# Altium schematic sheet Sheet1.SchDoc
size A; SheetNumber: 1; SheetTotal: 1
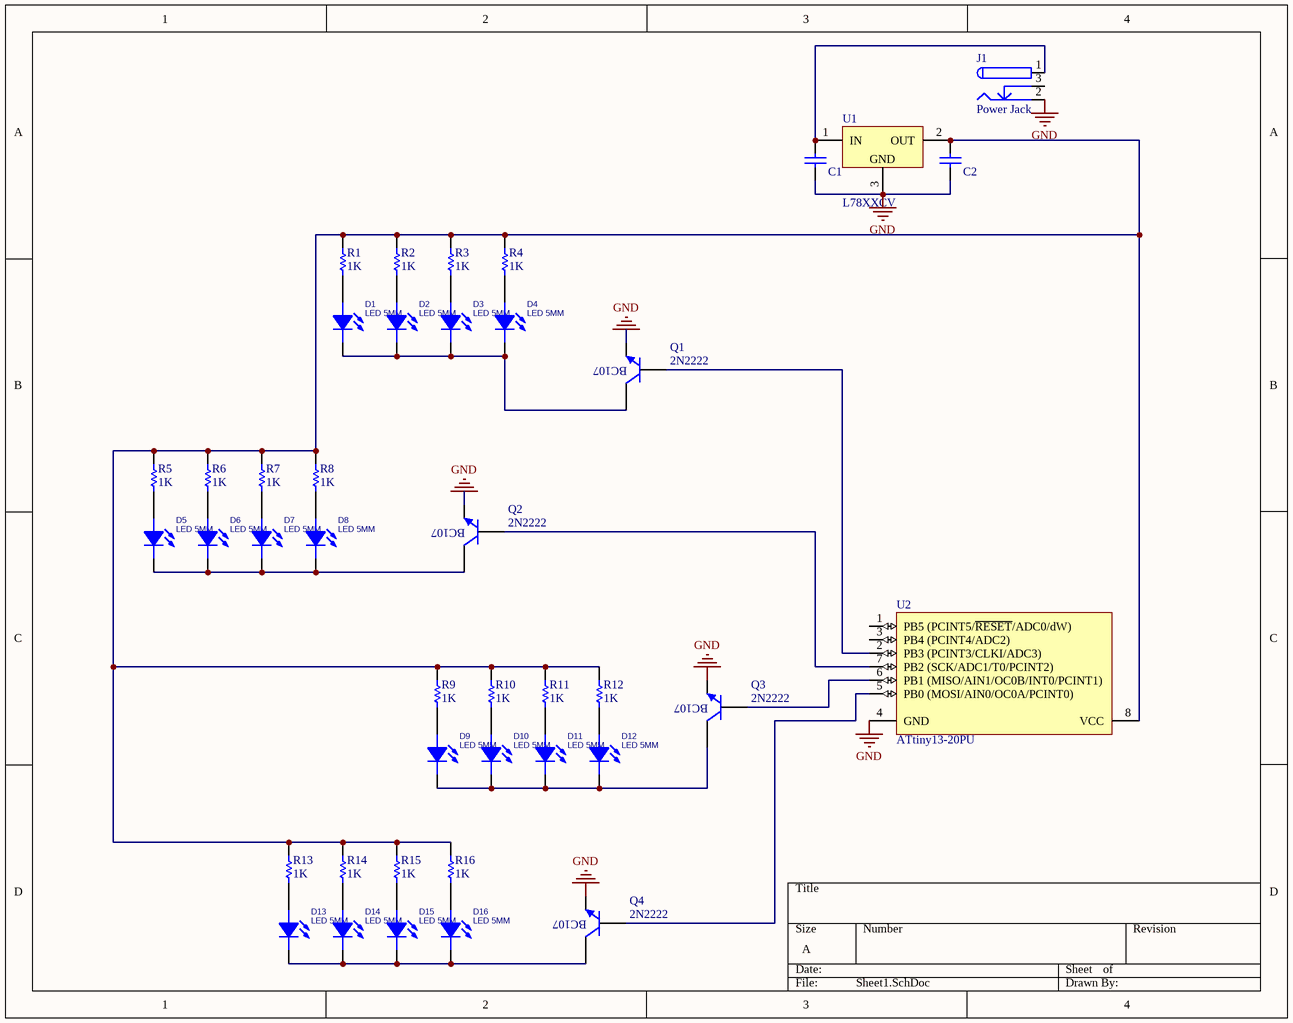
[diagram p0: Sheet1.SchDoc]

## Parts
C1  (no value)  [CBB22]
C2  (no value)  [CBB22]
D1  LED 5MM  [LED5MM_BLUE]
D2  LED 5MM  [LED5MM_BLUE]
D3  LED 5MM  [LED5MM_BLUE]
D4  LED 5MM  [LED5MM_BLUE]
D5  LED 5MM  [LED5MM_BLUE]
D6  LED 5MM  [LED5MM_BLUE]
D7  LED 5MM  [LED5MM_BLUE]
D8  LED 5MM  [LED5MM_BLUE]
D9  LED 5MM  [LED5MM_BLUE]
D10  LED 5MM  [LED5MM_BLUE]
D11  LED 5MM  [LED5MM_BLUE]
D12  LED 5MM  [LED5MM_BLUE]
D13  LED 5MM  [LED5MM_BLUE]
D14  LED 5MM  [LED5MM_BLUE]
D15  LED 5MM  [LED5MM_BLUE]
D16  LED 5MM  [LED5MM_BLUE]
J1  Power Jack  [Power Jack]
Q1  2N2222  [2N2222]
Q2  2N2222  [2N2222]
Q3  2N2222  [2N2222]
Q4  2N2222  [2N2222]
R1  1K  [RES-(1/1)]
R2  1K  [RES-(1/1)]
R3  1K  [RES-(1/1)]
R4  1K  [RES-(1/1)]
R5  1K  [RES-(1/1)]
R6  1K  [RES-(1/1)]
R7  1K  [RES-(1/1)]
R8  1K  [RES-(1/1)]
R9  1K  [RES-(1/1)]
R10  1K  [RES-(1/1)]
R11  1K  [RES-(1/1)]
R12  1K  [RES-(1/1)]
R13  1K  [RES-(1/1)]
R14  1K  [RES-(1/1)]
R15  1K  [RES-(1/1)]
R16  1K  [RES-(1/1)]
U1  L78XXCV  [78XXCV - Right]
U2  ATtiny13-20PU  [8P3]

## Nets
GND: C1.1 C2.1 J1.2 Q1.1(E) Q2.1(E) U1.3(GND) U2.4(GND)
NetC1_2: C1.2 J1.1 U1.1(IN)
NetC2_2: C2.2 R1.2 R2.2 R3.2 R4.2 R5.2 R6.2 R7.2 R8.2 R9.2 R10.2 R11.2 R12.2 R13.2 R14.2 R15.2 R16.2 U1.2(OUT) U2.8(VCC)
NetD1_1: D1.1(ANODE) R1.1
NetD1_2: D1.2(CATHODE) D2.2(CATHODE) D3.2(CATHODE) D4.2(CATHODE) Q1.3(C)
NetD2_1: D2.1(ANODE) R2.1
NetD3_1: D3.1(ANODE) R3.1
NetD4_1: D4.1(ANODE) R4.1
NetD5_1: D5.1(ANODE) R5.1
NetD5_2: D5.2(CATHODE) D6.2(CATHODE) D7.2(CATHODE) D8.2(CATHODE) Q2.3(C)
NetD6_1: D6.1(ANODE) R6.1
NetD7_1: D7.1(ANODE) R7.1
NetD8_1: D8.1(ANODE) R8.1
NetD9_1: D9.1(ANODE) R9.1
NetD9_2: D9.2(CATHODE) D10.2(CATHODE) D11.2(CATHODE) D12.2(CATHODE) Q3.3(C)
NetD10_1: D10.1(ANODE) R10.1
NetD11_1: D11.1(ANODE) R11.1
NetD12_1: D12.1(ANODE) R12.1
NetD13_1: D13.1(ANODE) R13.1
NetD13_2: D13.2(CATHODE) D14.2(CATHODE) D15.2(CATHODE) D16.2(CATHODE) Q4.3(C)
NetD14_1: D14.1(ANODE) R14.1
NetD15_1: D15.1(ANODE) R15.1
NetD16_1: D16.1(ANODE) R16.1
NetQ1_2: Q1.2(B) U2.2(PB3_(PCINT3/CLKI/ADC3))
NetQ2_2: Q2.2(B) U2.7(PB2_(SCK/ADC1/T0/PCINT2))
NetQ3_2: Q3.2(B) U2.6(PB1_(MISO/AIN1/OC0B/INT0/PCINT1))
NetQ4_2: Q4.2(B) U2.5(PB0_(MOSI/AIN0/OC0A/PCINT0))

Not connected (* = marked no-connect by the designer): J1 3; Q3 1(E); Q4 1(E); U2 1(PB5_(PCINT5/~{RESET}/ADC0/dW)) 3(PB4_(PCINT4/ADC2))

## Notes on the sheet
- Labels drawn without touching a wire or pin: GND
- (in symbol 2N2222) BC107

## Library data of the parts
C1 C2 = Cap CBB22 105J400V: Polypropylene film with epoxy Cap CBB22 105J400V; Manufacturer: CHINA; Designer: Abbas Basereh; Data: 16-12-2016; Link: https://www.alibaba.com/product-detail/CBB22-capacitors-105J-400V-1UF-400V_60020643516.html; Part. No: 105J400V
D1-D16 = LED 5MM: Light Emitting Diode; Designer: Abbas Basereh; Data: 16-12-2016; Link: *; Part.No: *
J1 = Power Jack: Designer: Saeid Jorablo; Company: Personal; Project Name: Laser; Adding Date: 10/21/2009
Q1-Q4 = 2N2222: NPN Transistor
R1-R16 = RES DIP PACKAGE: TOTAL DIP RESISTOR PACK; Designer: Ali Hafizi
U1 = L78XXCV: Fixed Voltage Regulator; Designer: Saeid Jorablo; Company: ControTec; Adding Date: 1387/01/06; Voltage: *
U2 = ATtiny13-20PU: 8-bit AVR Microcontroller, 2.7-5.5V, 1KB Flash, 64 Bytes EEPROM, 64 Bytes SRAM, 8-pin PDIP, Industrial Grade (-40°C to 85°C), Pb-Free; ComponentAvailability: Not recommended for new design.; Published: 2017-1-6; DatasheetVersion: revI, May-2008; PackageVersion: revB, Jan-2002; PackageReference: 8P3; Publisher: Abbas Basereh; PackageDescription: 8-Lead, 0.300" Wide Body, Plastic Dual In-Line Package (PDIP); Supplier 1: Digi-Key; Supplier Part Number 1: ATTINY13-20PU-ND; Supplier 2: Farnell; Supplier Part Number 2: 9171550; Supplier 3: Mouser; Supplier Part Number 3: 556-ATTINY13-20PU; Code_JEDEC: MS-001-BA; ComponentLink1Description: Manufacturer Link; ComponentLink1URL: http://www.atmel.com/products/avr/default.asp?; ComponentLink2Description: ATtiny13  Datasheet; ComponentLink2URL: http://www.atmel.com/dyn/resources/prod_documents/doc2535.pdf; ComponentLink3Description: ATtiny13 Summary; ComponentLink3URL: http://www.atmel.com/dyn/resources/prod_documents/2535S.pdf; ComponentLink4Description: Atmel.com Home; ComponentLink4URL: http://www.atmel.com